# EAGLE schematic 270_rev_00 (EAGLE 7.1.0)
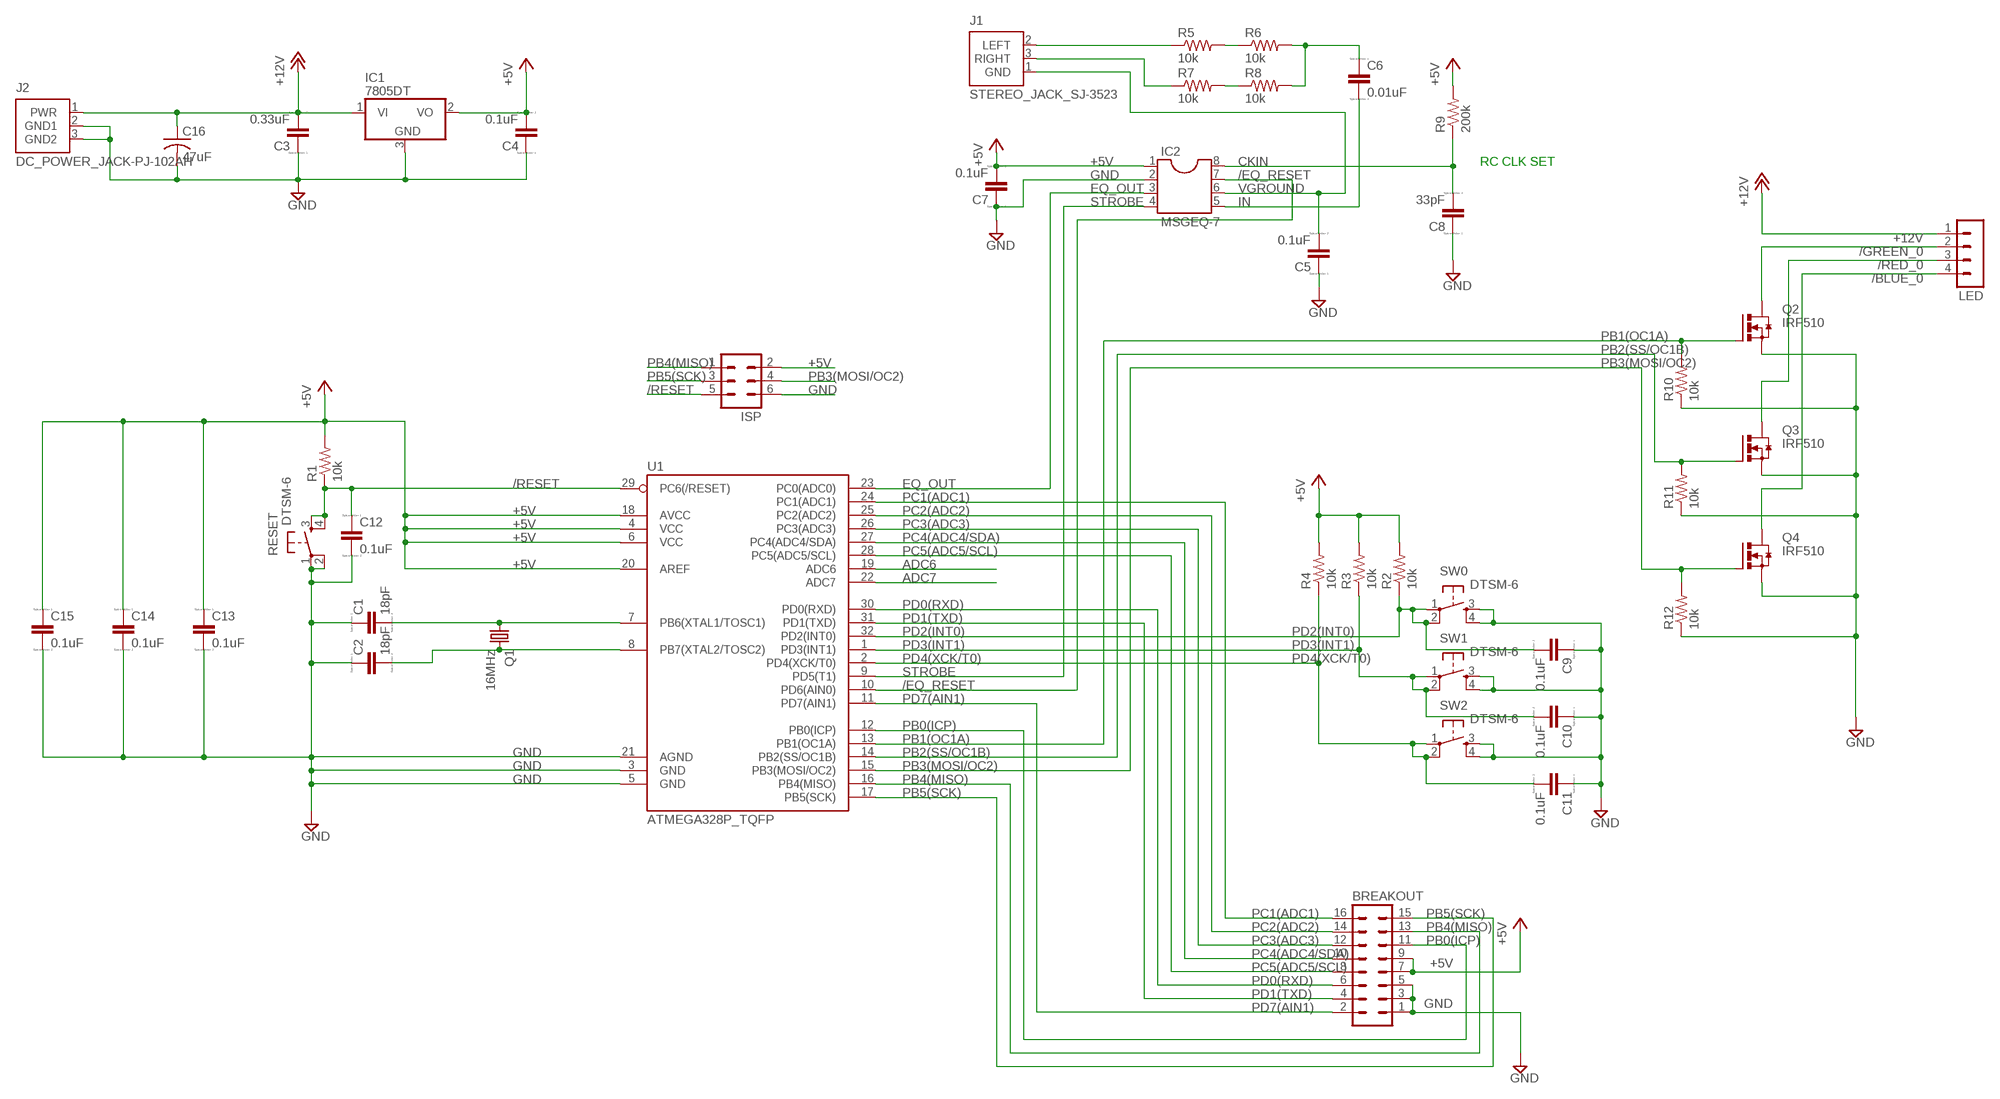
[diagram p0: schematic, sheet 1]

## Parts
BREAKOUT  MA08-2  [MA08-2]
C1  18pF  C-EUC0805K  [C0805K]
C2  18pF  C-EUC0805K  [C0805K]
C3  0.33uF  C-EUC0805K  [C0805K]
C4  0.1uF  C-EUC0805K  [C0805K]
C5  0.1uF  C-EUC0805K  [C0805K]
C6  0.01uF  C-EUC0805K  [C0805K]
C7  0.1uF  C-EUC0805K  [C0805K]
C8  33pF  C-EUC0805K  [C0805K]
C9  0.1uF  C-EUC0805K  [C0805K]
C10  0.1uF  C-EUC0805K  [C0805K]
C11  0.1uF  C-EUC0805K  [C0805K]
C12  0.1uF  C-EUC0805K  [C0805K]
C13  0.1uF  C-EUC0805K  [C0805K]
C14  0.1uF  C-EUC0805K  [C0805K]
C15  0.1uF  C-EUC0805K  [C0805K]
C16  47uF  C-USC1210K  [C1210K]
IC1  7805DT  [TO252]
IC2  MSGEQ-7  DIL8  [DIL08]
ISP  MA03-2  [MA03-2]
J1  STEREO_JACK_SJ-3523  [SJ-3523]
J2  DC_POWER_JACK-PJ-102AH  [PJ-102AH]
LED  MA04-1  [MA04-1]
Q1  16MHz  CRYSTALSM49  [SM49]
Q2  IRF510  IRF3704S  [D2PACK]
Q3  IRF510  IRF3704S  [D2PACK]
Q4  IRF510  IRF3704S  [D2PACK]
R1  10k  R-US_R0805  [R0805]
R2  10k  R-US_R0805  [R0805]
R3  10k  R-US_R0805  [R0805]
R4  10k  R-US_R0805  [R0805]
R5  10k  R-US_R0805  [R0805]
R6  10k  R-US_R0805  [R0805]
R7  10k  R-US_R0805  [R0805]
R8  10k  R-US_R0805  [R0805]
R9  200k  R-US_R0805  [R0805]
R10  10k  R-US_R0805  [R0805]
R11  10k  R-US_R0805  [R0805]
R12  10k  R-US_R0805  [R0805]
RESET  DTSM-6  [DTSM-6]
SW0  DTSM-6  [DTSM-6]
SW1  DTSM-6  [DTSM-6]
SW2  DTSM-6  [DTSM-6]
U1  ATMEGA328P_TQFP  [TQFP32-08]

## Nets
+5V: BREAKOUT.7 BREAKOUT.9 C4.2 C7.2 C13.1 C14.1 C15.1 IC1.2(VO) IC2.1 ISP.2 R1.2 R2.2 R3.2 R4.2 R9.2 U1.4(VCC) U1.6(VCC) U1.18(AVCC) U1.20(AREF)
+12V: C3.2 C16.1 IC1.1(VI) J2.1(PWR) LED.1
/BLUE_0: LED.4 Q4.2(D)
/EQ_RESET: IC2.7 U1.10(PD6(AIN0))
/GREEN_0: LED.2 Q2.2(D)
/RED_0: LED.3 Q3.2(D)
/RESET: C12.1 ISP.5 R1.1 RESET.3 RESET.4 U1.29(PC6(/RESET))
ADC6: U1.19(ADC6)
ADC7: U1.22(ADC7)
CKIN: C8.2 IC2.8 R9.1
EQ_OUT: IC2.3 U1.23(PC0(ADC0))
GND: BREAKOUT.1 BREAKOUT.3 BREAKOUT.5 C1.1 C2.1 C3.1 C4.1 C5.1 C7.1 C8.1 C9.1 C10.1 C11.1 C12.2 C13.2 C14.2 C15.2 C16.2 IC1.3(GND) IC2.2 ISP.6 J2.2(GND1) J2.3(GND2) Q2.3(S) Q3.3(S) Q4.3(S) R10.1 R11.1 R12.1 RESET.1 RESET.2 SW0.3 SW0.4 SW1.3 SW1.4 SW2.3 SW2.4 U1.3(GND) U1.5(GND) U1.21(AGND)
IN: C6.2 IC2.5
N$1: J1.2(LEFT) R5.1
N$2: J1.3(RIGHT) R7.1
N$3: R5.2 R6.1
N$4: R7.2 R8.1
N$5: C6.1 R6.2 R8.2
PB0(ICP): BREAKOUT.11 U1.12(PB0(ICP))
PB1(OC1A): Q2.1(G) R10.2 U1.13(PB1(OC1A))
PB2(SS/OC1B): Q3.1(G) R11.2 U1.14(PB2(SS/OC1B))
PB3(MOSI/OC2): ISP.4 Q4.1(G) R12.2 U1.15(PB3(MOSI/OC2))
PB4(MISO): BREAKOUT.13 ISP.1 U1.16(PB4(MISO))
PB5(SCK): BREAKOUT.15 ISP.3 U1.17(PB5(SCK))
PB6(XTAL1/TOSC1): C1.2 Q1.1 U1.7(PB6(XTAL1/TOSC1))
PB7(XTAL2/TOSC2): C2.2 Q1.2 U1.8(PB7(XTAL2/TOSC2))
PC1(ADC1): BREAKOUT.16 U1.24(PC1(ADC1))
PC2(ADC2): BREAKOUT.14 U1.25(PC2(ADC2))
PC3(ADC3): BREAKOUT.12 U1.26(PC3(ADC3))
PC4(ADC4/SDA): BREAKOUT.10 U1.27(PC4(ADC4/SDA))
PC5(ADC5/SCL): BREAKOUT.8 U1.28(PC5(ADC5/SCL))
PD0(RXD): BREAKOUT.6 U1.30(PD0(RXD))
PD1(TXD): BREAKOUT.4 U1.31(PD1(TXD))
PD2(INT0): C9.2 R2.1 SW0.1 SW0.2 U1.32(PD2(INT0))
PD3(INT1): C10.2 R3.1 SW1.1 SW1.2 U1.1(PD3(INT1))
PD4(XCK/T0): C11.2 R4.1 SW2.1 SW2.2 U1.2(PD4(XCK/T0))
PD7(AIN1): BREAKOUT.2 U1.11(PD7(AIN1))
STROBE: IC2.4 U1.9(PD5(T1))
VGROUND: C5.2 IC2.6 J1.1(GND)

## Notes on the sheet
- RC CLK SET

## Library data of the parts
BREAKOUT = con-lstb:MA08-2: PIN HEADER; OC_FARNELL: unknown; OC_NEWARK: unknown
C1-C15 = resistor:C-EU: CAPACITOR, European symbol; SPICEPREFIX: C
C16 = adafruit:C-US: CAPACITOR, American symbol
IC1 = linear:78*: Positive VOLTAGE REGULATOR Source: http://cache.national.com/ds/LM/LM78L05.pdf http://www.fairchildsemi.com/ds/LM/LM7805.pdf
IC2 = ic-package:DIL8: Dual In Line / Socket
ISP = con-lstb:MA03-2: PIN HEADER; OC_FARNELL: unknown; OC_NEWARK: unknown
J1 = connector:STEREO_JACK: CUI Inc. SJ-3523 stereo audio jack
J2 = connector:DC_POWER_JACK: DC Power Jack
LED = con-lstb:MA04-1: PIN HEADER; OC_FARNELL: unknown; OC_NEWARK: unknown
Q1 = adafruit:CRYSTAL: CRYSTAL; OC_FARNELL: unknown; OC_NEWARK: unknown
Q2-Q4 = transistor-power:IRF3704: SMPS MOSFET HEXFET® Power MOSFET Source: http://www.irf.com/product-info/datasheets/data/irf3704.pdf
R1-R12 = resistor:R-US_: RESISTOR, American symbol
RESET SW0 SW1 SW2 = switch-tact:DTSM-6
U1 = sparkfun:ATMEGA328P_TQFP; PROD_ID: IC-09069